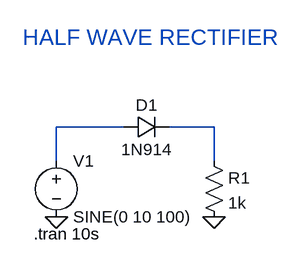
[diagram p0: schematic 3)half_wave_rectifier.asc]
3)half_wave_rectifier.asc, the LTspice schematic file:
Version 4
SHEET 1 880 680
WIRE 128 144 32 144
WIRE 256 144 192 144
WIRE 32 192 32 144
WIRE 256 192 256 144
FLAG 32 272 0
FLAG 256 272 0
SYMBOL diode 128 160 R270
WINDOW 0 32 32 VTop 2
WINDOW 3 0 32 VBottom 2
SYMATTR InstName D1
SYMATTR Value 1N914
SYMBOL voltage 32 176 R0
WINDOW 123 0 0 Left 0
WINDOW 39 0 0 Left 0
SYMATTR InstName V1
SYMATTR Value SINE(0 10 100)
SYMBOL res 240 176 R0
SYMATTR InstName R1
SYMATTR Value 1k
TEXT 0 296 Left 2 !.tran 10s
TEXT -16 16 Left 3 ;HALF WAVE RECTIFIER

The netlist it stands for:
* 3)half_wave_rectifier.asc
D1 N001 N002 1N914
V1 N001 0 SINE(0 10 100)
R1 N002 0 1k
.model D D
.lib standard.dio
.tran 10s
* HALF WAVE RECTIFIER
.backanno
.end